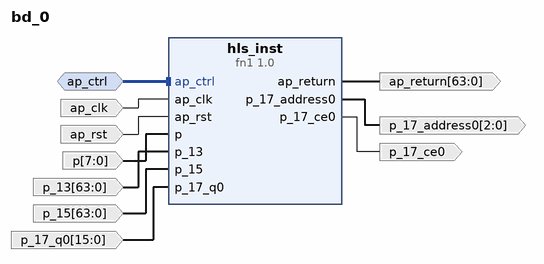
[diagram p0: block diagram of the top level]
# Vivado block design bd_0, xc7z020clg484-1, Vivado 2020.2
create_bd_design bd_0

create_bd_intf_port -mode Slave -vlnv xilinx.com:interface:acc_handshake_rtl:1.0 ap_ctrl
create_bd_port -dir I -type clk ap_clk
set_property -dict {CONFIG.FREQ_HZ 100000000.0} [get_bd_ports ap_clk]
create_bd_port -dir O -from 63 -to 0 -type data ap_return
create_bd_port -dir I -type rst ap_rst
set_property -dict {CONFIG.POLARITY ACTIVE_HIGH} [get_bd_ports ap_rst]
create_bd_port -dir I -from 7 -to 0 -type data p
create_bd_port -dir I -from 63 -to 0 -type data p_13
create_bd_port -dir I -from 63 -to 0 -type data p_15
create_bd_port -dir O -from 2 -to 0 -type data p_17_address0
create_bd_port -dir O p_17_ce0
create_bd_port -dir I -from 15 -to 0 -type data p_17_q0

create_bd_cell -type ip -vlnv xilinx.com:hls:fn1:1.0 hls_inst

# ---- connections ----

connect_bd_intf_net -intf_net ap_ctrl_0_1 [get_bd_intf_ports ap_ctrl] [get_bd_intf_pins hls_inst/ap_ctrl]
connect_bd_net -net ap_clk_0_1 [get_bd_ports ap_clk] [get_bd_pins hls_inst/ap_clk]
connect_bd_net [get_bd_pins hls_inst/ap_return] [get_bd_ports ap_return]
connect_bd_net -net ap_rst_0_1 [get_bd_ports ap_rst] [get_bd_pins hls_inst/ap_rst]
connect_bd_net -net p_0_1 [get_bd_ports p] [get_bd_pins hls_inst/p]
connect_bd_net -net p_13_0_1 [get_bd_ports p_13] [get_bd_pins hls_inst/p_13]
connect_bd_net -net p_15_0_1 [get_bd_ports p_15] [get_bd_pins hls_inst/p_15]
connect_bd_net [get_bd_pins hls_inst/p_17_address0] [get_bd_ports p_17_address0]
connect_bd_net [get_bd_pins hls_inst/p_17_ce0] [get_bd_ports p_17_ce0]
connect_bd_net -net p_17_q0_0_1 [get_bd_ports p_17_q0] [get_bd_pins hls_inst/p_17_q0]

validate_bd_design
save_bd_design
